# Altium project Orient.PrjPcb (part 1 of 6)
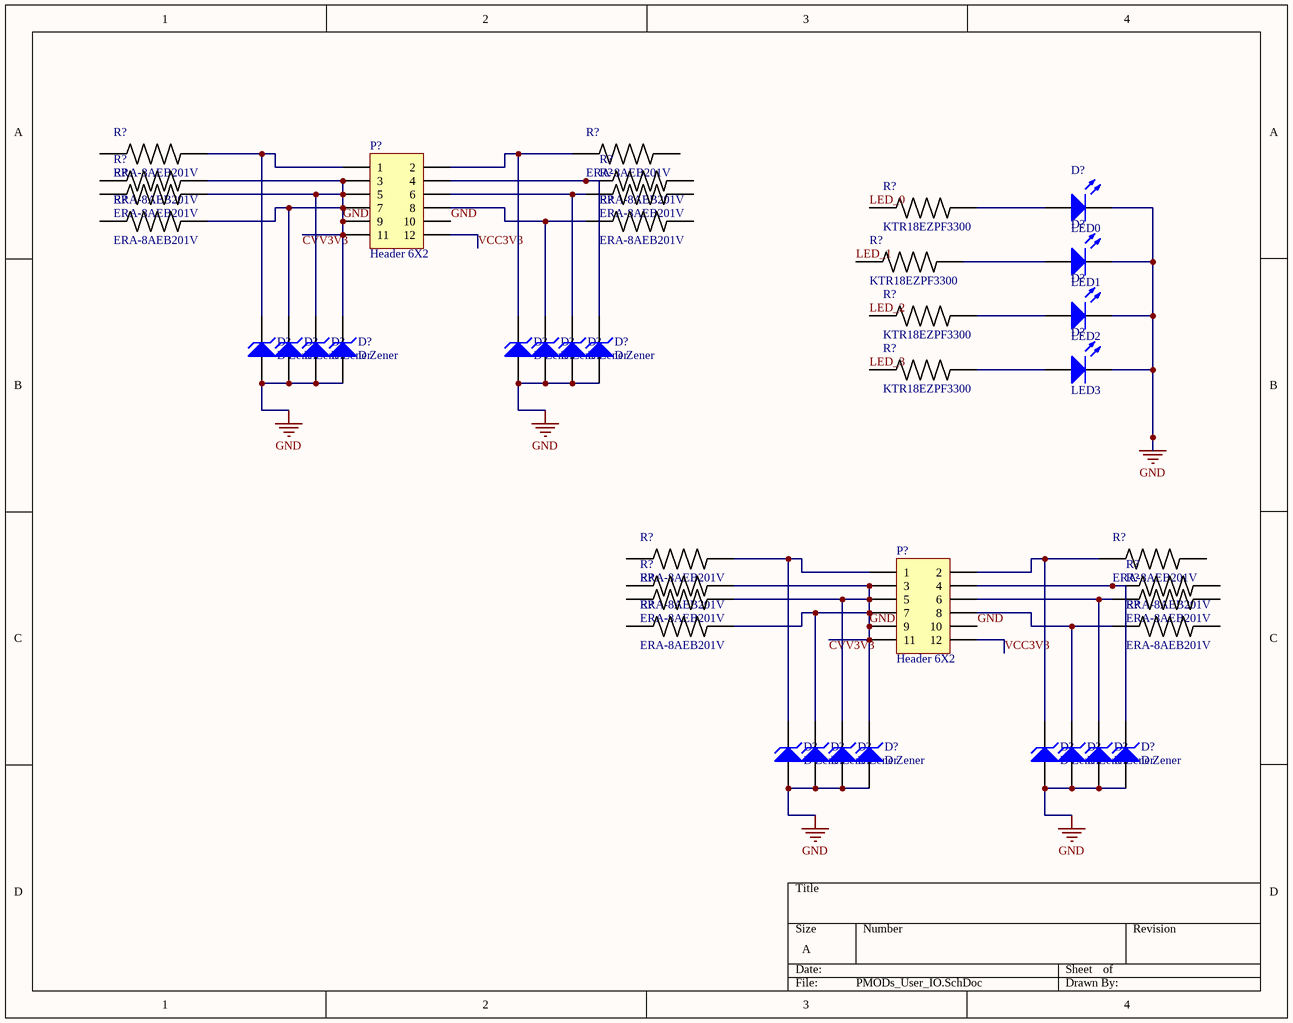
[diagram p0: PMODs_User_IO.SchDoc]
12 sheets, 302 parts. Net scope: global (net labels, ports and power ports of the same name join across sheets).
Sheets:
  PMODs_User_IO.SchDoc
  CHipKIT_IO.SchDoc
  Ethernet_SD_Card.SchDoc
  HDMI.SchDoc
  USB_Mic_Audio_Out.SchDoc
  FPGA_Config_Flash.SchDoc
  DDR_MIO_Banks.SchDoc
  FPGA_Banks_Anti_Alias.SchDoc
  FPGA_Power.SchDoc
  DDR3_Memory.SchDoc
  Power_Regulation1.SchDoc
  Power_Regulation2.SchDoc

## Sheet PMODs_User_IO.SchDoc
size A

### Parts
(Parts that share a designator on the sheet are numbered #1, #2 ... from top to bottom, then left to right.)
D?#1  LED0  [LED-0]
D?#2  LED1  [LED-1]
D?#3  LED2  [3.2X1.6X1.1]
D?#4  D Zener  [DIODE-0.7]
D?#5  D Zener  [DIODE-0.7]
D?#6  D Zener  [DIODE-0.7]
D?#7  D Zener  [DIODE-0.7]
D?#8  D Zener  [DIODE-0.7]
D?#9  D Zener  [DIODE-0.7]
D?#10  D Zener  [DIODE-0.7]
D?#11  D Zener  [DIODE-0.7]
D?#12  LED3  [3.5X2.8X1.9]
D?#13  D Zener  [DIODE-0.7]
D?#14  D Zener  [DIODE-0.7]
D?#15  D Zener  [DIODE-0.7]
D?#16  D Zener  [DIODE-0.7]
D?#17  D Zener  [DIODE-0.7]
D?#18  D Zener  [DIODE-0.7]
D?#19  D Zener  [DIODE-0.7]
D?#20  D Zener  [DIODE-0.7]
P?#1  Header 6X2  [HDR2X6]
P?#2  Header 6X2  [HDR2X6]
R?#1  ERA-8AEB201V  [*RESC3216X70N]
R?#2  ERA-8AEB201V  [*RESC3216X70N]
R?#3  ERA-8AEB201V  [*RESC3216X70N]
R?#4  ERA-8AEB201V  [*RESC3216X70N]
R?#5  ERA-8AEB201V  [*RESC3216X70N]
R?#6  ERA-8AEB201V  [*RESC3216X70N]
R?#7  KTR18EZPF3300  [*RESC3216X65N]
R?#8  ERA-8AEB201V  [*RESC3216X70N]
R?#9  ERA-8AEB201V  [*RESC3216X70N]
R?#10  KTR18EZPF3300  [*RESC3216X65N]
R?#11  KTR18EZPF3300  [*RESC3216X65N]
R?#12  KTR18EZPF3300  [*RESC3216X65N]
R?#13  ERA-8AEB201V  [*RESC3216X70N]
R?#14  ERA-8AEB201V  [*RESC3216X70N]
R?#15  ERA-8AEB201V  [*RESC3216X70N]
R?#16  ERA-8AEB201V  [*RESC3216X70N]
R?#17  ERA-8AEB201V  [*RESC3216X70N]
R?#18  ERA-8AEB201V  [*RESC3216X70N]
R?#19  ERA-8AEB201V  [*RESC3216X70N]
R?#20  ERA-8AEB201V  [*RESC3216X70N]

### Nets
GND: D?#1.2(K) D?#2.2(K) D?#3.2(K) D?#4.1(A) D?#5.1(A) D?#5.2(K) D?#6.1(A) D?#6.2(K) D?#7.1(A) D?#7.2(K) D?#8.1(A) D?#9.1(A) D?#10.1(A) D?#11.1(A) D?#12.2(K) D?#13.1(A) D?#14.1(A) D?#14.2(K) D?#15.1(A) D?#15.2(K) D?#16.1(A) D?#16.2(K) D?#17.1(A) D?#18.1(A) D?#19.1(A) D?#20.1(A) P?#1.3 P?#1.5 P?#1.7 P?#1.9 P?#1.10 P?#1.11 P?#2.3 P?#2.5 P?#2.7 P?#2.9 P?#2.10 P?#2.11 R?#3.2 R?#5.2 R?#8.2 R?#15.2 R?#17.2 R?#19.2
LED_0: R?#7.1
LED_1: R?#10.1
LED_2: R?#11.1
LED_3: R?#12.1
VCC3V3: P?#1.12 P?#2.12
NetD?#1_1: D?#1.1(A) R?#7.2
NetD?#2_1: D?#2.1(A) R?#10.2
NetD?#3_1: D?#3.1(A) R?#11.2
NetD?#4_2: D?#4.2(K) P?#1.1 R?#1.2
NetD?#8_2: D?#8.2(K) P?#1.2 R?#2.1
NetD?#9_2: D?#9.2(K) P?#1.8 R?#9.1
NetD?#10_2: D?#10.2(K) P?#1.6 R?#6.1
NetD?#11_2: D?#11.2(K) P?#1.4 R?#4.1
NetD?#12_1: D?#12.1(A) R?#12.2
NetD?#13_2: D?#13.2(K) P?#2.1 R?#13.2
NetD?#17_2: D?#17.2(K) P?#2.2 R?#14.1
NetD?#18_2: D?#18.2(K) P?#2.8 R?#20.1
NetD?#19_2: D?#19.2(K) P?#2.6 R?#18.1
NetD?#20_2: D?#20.2(K) P?#2.4 R?#16.1

Not connected (* = marked no-connect by the designer): R?#1 1; R?#2 2; R?#3 1; R?#4 2; R?#5 1; R?#6 2; R?#8 1; R?#9 2; R?#13 1; R?#14 2; R?#15 1; R?#16 2; R?#17 1; R?#18 2; R?#19 1; R?#20 2

### Notes on the sheet
- Labels drawn without touching a wire or pin: CVV3V3

### Library data of the parts
D?#1 = LED0: Typical INFRARED GaAs LED; Published: 8-Jun-2000; LatestRevisionDate: 08-Jul-2005; LatestRevisionNote: Mech Layer 1 removed.; PackageReference: LED-0; Publisher: Altium Limited; PackageDescription: LED; 2 Leads
D?#2 = LED1: Typical RED GaAs LED; Published: 8-Jun-2000; LatestRevisionDate: 08-Jul-2005; LatestRevisionNote: Mech Layer 1 removed.; PackageReference: LED-1; Publisher: Altium Limited; PackageDescription: LED; 2 Leads
D?#3 = LED2: Typical RED, GREEN, YELLOW, AMBER GaAs LED; Published: 8-Jun-2000; LatestRevisionDate: 17-Jul-2002; LatestRevisionNote: Re-released for DXP Platform.; PackageVersion: Feb-2002; PackageReference: 3.2X1.6X1.1; Publisher: Altium Limited; PackageDescription: SM LED; 2 Flat Leads
D?#4-D?#11 D?#13-D?#20 = D Zener: Zener Diode; Published: 8-Jun-2000; LatestRevisionDate: 17-Jul-2002; LatestRevisionNote: Re-released for DXP Platform.; PackageReference: DIODE-0.7; Publisher: Altium Limited; PackageDescription: Diode, Thru-Hole; 2 Leads; 0.7 in Pin Spacing
D?#12 = LED3: Typical BLUE SiC LED; Published: 8-Jun-2000; LatestRevisionDate: 17-Dec-2003; LatestRevisionNote: PCB Footprint replaced.; DatasheetVersion: 16-Apr-2002; PackageVersion: 16-Apr-2002; PackageReference: 3.5X2.8X1.9; Publisher: Altium Limited; PackageDescription: SM LED; 2 C-Bend Leads; Body 3.5 x 2.8 x 1.9 mm, inc leads (LxWxH typ)
P?#1 P?#2 = Header 6X2: Header, 6-Pin, Dual row; LatestRevisionDate: 17-Jul-2002; LatestRevisionNote: Re-released for DXP Platform.; Publisher: Altium Limited
R?#1-R?#6 R?#8 R?#9 R?#13-R?#20 = ERA-8AEB201V: / Res Thin Film 1206 200 Ohm 0.1% 0.25W_1/4W_ Â±25ppm/C Pad SMD Automotive T/R /; MF: Panasonic; SnapEDA_Link: https://www.snapeda.com/parts/ERA-8AEB201V/Panasonic%20Electronic%20Components/view-part/?ref=snap; Availability: Unavailable; Price: None; MP: ERA-8AEB201V; Package: 3216 Panasonic Electronic Components; Value: *
R?#7 R?#10-R?#12 = KTR18EZPF3300: MF: Rohm; SnapEDA_Link: https://www.snapeda.com/parts/KTR18EZPF3300/Rohm/view-part/?ref=snap; Availability: Unavailable; Price: None; MP: KTR18EZPF3300; Package: 3216 Rohm Semiconductor; Value: *

## Sheet CHipKIT_IO.SchDoc
size A
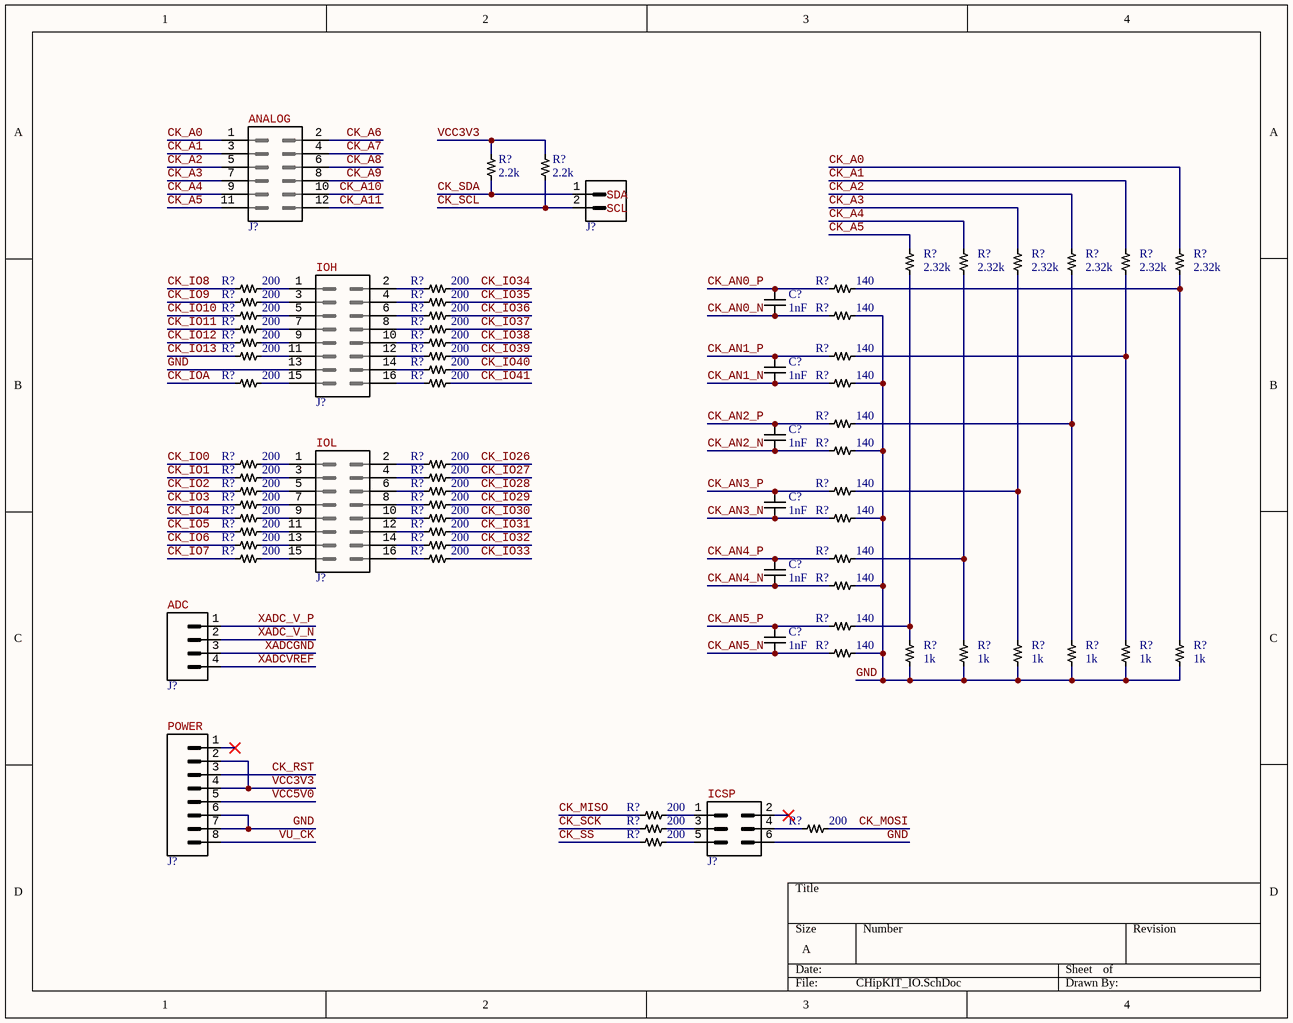
[diagram p1: CHipKIT_IO.SchDoc]

### Parts
(Parts that share a designator on the sheet are numbered #1, #2 ... from top to bottom, then left to right.)
C?#1  1nF  [CAP0402]
C?#2  1nF  [CAP0402]
C?#3  1nF  [CAP0402]
C?#4  1nF  [CAP0402]
C?#5  1nF  [CAP0402]
C?#6  1nF  [CAP0402]
J?#1  2x6 Header  [HEADER_2X6]  (value not drawn)
J?#2  1x2 Header  [HEADER_1X2]  (value not drawn)
J?#3  2x8 Header  [HEADER_2x8]  (value not drawn)
J?#4  2x8 Header  [HEADER_2x8]  (value not drawn)
J?#5  1x4 Header  [HEADER_1X4]  (value not drawn)
J?#6  1x8 Header  [HEADER_1X8]  (value not drawn)
J?#7  2x3 Header  [HEADER_2X3]  (value not drawn)
R?#21  2.2k  [RES0402]
R?#22  2.2k  [RES0402]
R?#23  2.32k  [RES0402]
R?#24  2.32k  [RES0402]
R?#25  2.32k  [RES0402]
R?#26  2.32k  [RES0402]
R?#27  2.32k  [RES0402]
R?#28  2.32k  [RES0402]
R?#29  200  [RES0402]
R?#30  200  [RES0402]
R?#31  140  [RES0402]
R?#32  200  [RES0402]
R?#33  200  [RES0402]
R?#34  200  [RES0402]
R?#35  200  [RES0402]
R?#36  140  [RES0402]
R?#37  200  [RES0402]
R?#38  200  [RES0402]
R?#39  200  [RES0402]
R?#40  200  [RES0402]
R?#41  200  [RES0402]
R?#42  200  [RES0402]
R?#43  140  [RES0402]
R?#44  200  [RES0402]
R?#45  200  [RES0402]
R?#46  200  [RES0402]
R?#47  140  [RES0402]
R?#48  140  [RES0402]
R?#49  140  [RES0402]
R?#50  200  [RES0402]
R?#51  200  [RES0402]
R?#52  200  [RES0402]
R?#53  200  [RES0402]
R?#54  200  [RES0402]
R?#55  200  [RES0402]
R?#56  140  [RES0402]
R?#57  200  [RES0402]
R?#58  200  [RES0402]
R?#59  200  [RES0402]
R?#60  200  [RES0402]
R?#61  140  [RES0402]
R?#62  200  [RES0402]
R?#63  200  [RES0402]
R?#64  200  [RES0402]
R?#65  200  [RES0402]
R?#66  200  [RES0402]
R?#67  200  [RES0402]
R?#68  140  [RES0402]
R?#69  140  [RES0402]
R?#70  140  [RES0402]
R?#71  140  [RES0402]
R?#72  1k  [RES0402]
R?#73  1k  [RES0402]
R?#74  1k  [RES0402]
R?#75  1k  [RES0402]
R?#76  1k  [RES0402]
R?#77  1k  [RES0402]
R?#78  200  [RES0402]
R?#79  200  [RES0402]
R?#80  200  [RES0402]
R?#81  200  [RES0402]

### Nets
GND: J?#3.13 J?#6.6 J?#6.7 J?#7.6 R?#36.2 R?#47.2 R?#49.2 R?#61.2 R?#69.2 R?#71.2 R?#72.1 R?#73.1 R?#74.1 R?#75.1 R?#76.1 R?#77.1
CK_A0: J?#1.1 R?#28.2
CK_A1: J?#1.3 R?#27.2
CK_A2: J?#1.5 R?#26.2
CK_A3: J?#1.7 R?#25.2
CK_A4: J?#1.9 R?#24.2
CK_A5: J?#1.11 R?#23.2
CK_A6: J?#1.2
CK_A7: J?#1.4
CK_A8: J?#1.6
CK_A9: J?#1.8
CK_A10: J?#1.10
CK_A11: J?#1.12
CK_AN0_N: C?#1.2 R?#36.1
CK_AN0_P: C?#1.1 R?#31.1
CK_AN1_N: C?#2.2 R?#47.1
CK_AN1_P: C?#2.1 R?#43.1
CK_AN2_N: C?#3.2 R?#49.1
CK_AN2_P: C?#3.1 R?#48.1
CK_AN3_N: C?#4.2 R?#61.1
CK_AN3_P: C?#4.1 R?#56.1
CK_AN4_N: C?#5.2 R?#69.1
CK_AN4_P: C?#5.1 R?#68.1
CK_AN5_N: C?#6.2 R?#71.1
CK_AN5_P: C?#6.1 R?#70.1
CK_IO0: R?#50.1
CK_IO1: R?#52.1
CK_IO2: R?#54.1
CK_IO3: R?#57.1
CK_IO4: R?#59.1
CK_IO5: R?#62.1
CK_IO6: R?#64.1
CK_IO7: R?#66.1
CK_IO8: R?#29.1
CK_IO9: R?#32.1
CK_IO10: R?#34.1
CK_IO11: R?#37.1
CK_IO12: R?#39.1
CK_IO13: R?#41.1
CK_IO26: R?#51.2
CK_IO27: R?#53.2
CK_IO28: R?#55.2
CK_IO29: R?#58.2
CK_IO30: R?#60.2
CK_IO31: R?#63.2
CK_IO32: R?#65.2
CK_IO33: R?#67.2
CK_IO34: R?#30.2
CK_IO35: R?#33.2
CK_IO36: R?#35.2
CK_IO37: R?#38.2
CK_IO38: R?#40.2
CK_IO39: R?#42.2
CK_IO40: R?#44.2
CK_IO41: R?#46.2
CK_IOA: R?#45.1
CK_MISO: R?#78.1
CK_MOSI: R?#80.2
CK_RST: J?#6.3
CK_SCK: R?#79.1
CK_SCL: J?#2.2 R?#22.1
CK_SDA: J?#2.1 R?#21.1
CK_SS: R?#81.1
VCC3V3: J?#6.2 J?#6.4 R?#21.2 R?#22.2
VCC5V0: J?#6.5
VU_CK: J?#6.8
XADC_V_N: J?#5.2
XADC_V_P: J?#5.1
XADCGND: J?#5.3
XADCVREF: J?#5.4
NetJ?#3_1: J?#3.1 R?#29.2
NetJ?#3_2: J?#3.2 R?#30.1
NetJ?#3_3: J?#3.3 R?#32.2
NetJ?#3_4: J?#3.4 R?#33.1
NetJ?#3_5: J?#3.5 R?#34.2
NetJ?#3_6: J?#3.6 R?#35.1
NetJ?#3_7: J?#3.7 R?#37.2
NetJ?#3_8: J?#3.8 R?#38.1
NetJ?#3_9: J?#3.9 R?#39.2
NetJ?#3_10: J?#3.10 R?#40.1
NetJ?#3_11: J?#3.11 R?#41.2
NetJ?#3_12: J?#3.12 R?#42.1
NetJ?#3_14: J?#3.14 R?#44.1
NetJ?#3_15: J?#3.15 R?#45.2
NetJ?#3_16: J?#3.16 R?#46.1
NetJ?#4_1: J?#4.1 R?#50.2
NetJ?#4_2: J?#4.2 R?#51.1
NetJ?#4_3: J?#4.3 R?#52.2
NetJ?#4_4: J?#4.4 R?#53.1
NetJ?#4_5: J?#4.5 R?#54.2
NetJ?#4_6: J?#4.6 R?#55.1
NetJ?#4_7: J?#4.7 R?#57.2
NetJ?#4_8: J?#4.8 R?#58.1
NetJ?#4_9: J?#4.9 R?#59.2
NetJ?#4_10: J?#4.10 R?#60.1
NetJ?#4_11: J?#4.11 R?#62.2
NetJ?#4_12: J?#4.12 R?#63.1
NetJ?#4_13: J?#4.13 R?#64.2
NetJ?#4_14: J?#4.14 R?#65.1
NetJ?#4_15: J?#4.15 R?#66.2
NetJ?#4_16: J?#4.16 R?#67.1
NetJ?#7_1: J?#7.1 R?#78.2
NetJ?#7_3: J?#7.3 R?#79.2
NetJ?#7_4: J?#7.4 R?#80.1
NetJ?#7_5: J?#7.5 R?#81.2
NetR?#23_1: R?#23.1 R?#70.2 R?#72.2
NetR?#24_1: R?#24.1 R?#68.2 R?#73.2
NetR?#25_1: R?#25.1 R?#56.2 R?#74.2
NetR?#26_1: R?#26.1 R?#48.2 R?#75.2
NetR?#27_1: R?#27.1 R?#43.2 R?#76.2
NetR?#28_1: R?#28.1 R?#31.2 R?#77.2

Not connected (* = marked no-connect by the designer): J?#6 1*; J?#7 2(4)*

### Notes on the sheet
- (near J?#1) ANALOG
- (near J?#2) SDA
- (near J?#2) SCL
- (near J?#3) IOH
- (near J?#4) IOL
- (near J?#5) ADC
- (near J?#6) POWER
- (near J?#7) ICSP

### Library data of the parts
C?#1-C?#6 = GCM155R71H102KA37D: MLCC 1nF 0402 SMD; Manufacturer: Murata; Voltage Rating: 50V; Tolerance: 10%; Dielectric: X7R; Supplier 1: Digi-Key; Manufacturer Part Number: GCM155R71H102KA37D; Stock 1: 18060146; Pricing 1: 1=0.10000, 10=0.03900, 100=0.01720, 500=0.01228, 1000=0.00965, 2500=0.00878, 5000=0.00807 (USD); RoHS: Yes; Mount: Surface Mount; Case/Package: 0402; Case Code (Metric): 1005; Case Code (Imperial): 0402; Min Operating Temperature: -55°C; Max Operating Temperature: 125°C; Package Quantity: 1; Capacitance: 1nF; Packaging: Tape and Reel; Voltage Rating (DC): 50V; Termination: SMD/SMT; Voltage: 50V; Length: 1mm; Height: 0.5mm; Width: 0.02inch; Thickness: 0.022inch; Depth: 0.5mm; Ratings: AEC-Q200; Radiation Hardening: No; REACH SVHC: No SVHC; Lead Free: Lead Free; ComponentLink1URL: https://datasheet.ciiva.com/130/product-130720.pdf?src-supplier=Digi-Key; ComponentLink1Description: https://datasheet.ciiva.com/130/product-130720.pdf?src-supplier=Digi-Key; ComponentLink2URL: https://datasheet.ciiva.com/18183/getdatasheetpartid-140970-18183520.pdf?src-supplier=Verical; ComponentLink2Description: https://datasheet.ciiva.com/18183/getdatasheetpartid-140970-18183520.pdf?src-supplier=Verical; ComponentLink3URL: https://datasheet.ciiva.com/3778/3103gcm155r71h102ka3723-3778878.pdf?src-supplier=Arrow; ComponentLink3Description: https://datasheet.ciiva.com/3778/3103gcm155r71h102ka3723-3778878.pdf?src-supplier=Arrow; ComponentLink4URL: https://datasheet.ciiva.com/11786/0900766b80ef92d0-11786143.pdf?src-supplier=RSComponents; ComponentLink4Description: https://datasheet.ciiva.com/11786/0900766b80ef92d0-11786143.pdf?src-supplier=RSComponents; ComponentLink5URL: https://datasheet.ciiva.com/16213/product-16213384.pdf?src-supplier=Future+Electronics; ComponentLink5Description: https://datasheet.ciiva.com/16213/product-16213384.pdf?src-supplier=Future+Electronics
J?#1 = PPTC062LFBN-RC: Header Female 2x6 2.54mm; Manufacturer: Sullins; Number of Positions: 12; Connector Type: Header,Socket; Pitch: 0.1inch; Supplier 1: Digi-Key; Manufacturer Part Number: PPTC062LFBN-RC; Stock 1: 4618; Pricing 1: 1=0.79000, 10=0.69100, 100=0.59600, 500=0.48762, 1000=0.43344, 5000=0.39130 (USD); RoHS: Yes; Mount: Through Hole; Color: Black; Contact Plating: Tin; Contact Material: Bronze; Housing Material: Plastic; Package Quantity: 1000; Number of Rows: 2; Packaging: Bulk; Termination: Solder; Length: 15.7mm; Height: 8.5mm; Row Spacing: 0.1inch; Width: 5mm; Lead Free: Lead Free; ComponentLink1URL: https://media.digikey.com/pdf/Data%20Sheets/Sullins%20PDFs/Female_Headers.100_DS.pdf?src-supplier=Digi-Key; ComponentLink1Description: https://media.digikey.com/pdf/Data%20Sheets/Sullins%20PDFs/Female_Headers.100_DS.pdf?src-supplier=Digi-Key; ComponentLink2URL: http://www.sullinscorp.com/catalogs/78_Page80-81_HEADER_.100_2.54mm_FEMALE.pdf?src-supplier=Future+Electronics; ComponentLink2Description: http://www.sullinscorp.com/catalogs/78_Page80-81_HEADER_.100_2.54mm_FEMALE.pdf?src-supplier=Future+Electronics
J?#2 = PPTC021LFBN-RC: Header Female 1x2 2.54mm; Manufacturer: Sullins; Number of Positions: 2; Connector Type: Header,Socket; Pitch: 0.1inch; Supplier 1: Digi-Key; Manufacturer Part Number: PPTC021LFBN-RC; Stock 1: 29257; Pricing 1: 1=0.32000, 10=0.30600, 100=0.21390, 500=0.18334, 1000=0.15278, 5000=0.13095, 10000=0.12610 (USD); RoHS: Yes; Mount: Through Hole; Color: Black; Contact Plating: Tin; Contact Material: Bronze; Housing Material: Plastic; Package Quantity: 1000; Number of Rows: 1; Packaging: Bulk; Termination: Solder; Length: 5.58mm; Height: 8.5mm; Width: 2.5mm; Lead Free: Lead Free; ComponentLink1URL: https://media.digikey.com/pdf/Data%20Sheets/Sullins%20PDFs/Female_Headers.100_DS.pdf?src-supplier=Digi-Key; ComponentLink1Description: https://media.digikey.com/pdf/Data%20Sheets/Sullins%20PDFs/Female_Headers.100_DS.pdf?src-supplier=Digi-Key; ComponentLink2URL: http://www.sullinscorp.com/catalogs/78_Page80-81_HEADER_.100_2.54mm_FEMALE.pdf?src-supplier=Future+Electronics; ComponentLink2Description: http://www.sullinscorp.com/catalogs/78_Page80-81_HEADER_.100_2.54mm_FEMALE.pdf?src-supplier=Future+Electronics
J?#3 J?#4 = PPTC082LFBN-RC: Header Female 2x8 2.54mm; Manufacturer: Sullins; Number of Positions: 16; Connector Type: Header,Socket; Pitch: 0.1inch; Supplier 1: Digi-Key; Manufacturer Part Number: PPTC082LFBN-RC; Stock 1: 5065; Pricing 1: 1=0.99000, 10=0.87000, 100=0.75040, 500=0.61398, 1000=0.54576, 5000=0.49270 (USD); RoHS: Yes; Mount: Through Hole; Color: Black; Contact Plating: Tin; Contact Material: Bronze; Housing Material: Plastic; Package Quantity: 1000; Number of Rows: 2; Packaging: Bulk; Termination: Solder; Length: 20.8mm; Height: 8.5mm; Row Spacing: 0.1inch; Width: 5mm; Lead Free: Lead Free; ComponentLink1URL: http://www.sullinscorp.com/catalogs/101_Page80-81_HEADER_.100_2.54mm_FEMALE.pdf?src-supplier=Future+Electronics; ComponentLink1Description: http://www.sullinscorp.com/catalogs/101_Page80-81_HEADER_.100_2.54mm_FEMALE.pdf?src-supplier=Future+Electronics; ComponentLink2URL: https://drawings-pdf.s3.amazonaws.com/10492.pdf?src-supplier=Digi-Key; ComponentLink2Description: https://drawings-pdf.s3.amazonaws.com/10492.pdf?src-supplier=Digi-Key
J?#5 = PPTC041LFBN-RC: Header Female 1x4 2.54mm; Manufacturer: Sullins; Number of Positions: 4; Connector Type: Header,Socket; Pitch: 0.1inch; Supplier 1: Digi-Key; Manufacturer Part Number: PPTC041LFBN-RC; Stock 1: 5302; Pricing 1: 1=0.45000, 10=0.42400, 100=0.32500, 500=0.28260, 1000=0.23315, 5000=0.20489, 10000=0.20410 (USD); RoHS: Yes; Mount: Through Hole; Color: Black; Contact Plating: Tin; Contact Material: Bronze; Housing Material: Plastic; Package Quantity: 1000; Number of Rows: 1; Packaging: Bulk; Termination: Solder; Length: 10.7mm; Height: 8.5mm; Width: 2.5mm; Lead Free: Lead Free; ComponentLink1URL: https://media.digikey.com/pdf/Data%20Sheets/Sullins%20PDFs/Female_Headers.100_DS.pdf?src-supplier=Digi-Key; ComponentLink1Description: https://media.digikey.com/pdf/Data%20Sheets/Sullins%20PDFs/Female_Headers.100_DS.pdf?src-supplier=Digi-Key; ComponentLink2URL: http://www.sullinscorp.com/catalogs/78_Page80-81_HEADER_.100_2.54mm_FEMALE.pdf?src-supplier=Future+Electronics; ComponentLink2Description: http://www.sullinscorp.com/catalogs/78_Page80-81_HEADER_.100_2.54mm_FEMALE.pdf?src-supplier=Future+Electronics
J?#6 = PPTC081LFBN-RC: Header Female 1x8 2.54mm; Manufacturer: Sullins; Number of Positions: 8; Connector Type: Header,Socket; Pitch: 0.1inch; Supplier 1: Future Electronics; Manufacturer Part Number: PPTC081LFBN-RC; Stock 1: 2015; Pricing 1: 1=0.59500, 100=0.42000, 300=0.39000, 1000=0.35500, 3000=0.32500 (USD); RoHS: Yes; Mount: Through Hole; Color: Black; Contact Plating: Tin; Contact Material: Bronze; Housing Material: Plastic; Package Quantity: 1000; Number of Rows: 1; Packaging: Bulk; Termination: Solder; Length: 20.8mm; Height: 8.5mm; Width: 2.5mm; Lead Free: Lead Free; ComponentLink1URL: https://media.digikey.com/pdf/Data%20Sheets/Sullins%20PDFs/Female_Headers.100_DS.pdf?src-supplier=Digi-Key; ComponentLink1Description: https://media.digikey.com/pdf/Data%20Sheets/Sullins%20PDFs/Female_Headers.100_DS.pdf?src-supplier=Digi-Key; ComponentLink2URL: http://www.sullinscorp.com/catalogs/78_Page80-81_HEADER_.100_2.54mm_FEMALE.pdf?src-supplier=Future+Electronics; ComponentLink2Description: http://www.sullinscorp.com/catalogs/78_Page80-81_HEADER_.100_2.54mm_FEMALE.pdf?src-supplier=Future+Electronics
J?#7 = PREC003DAAN-RC: Header Male 2x3 2.54mm
R?#21 R?#22 = RC0402FR-072K2L: Resistor 2.2kOhm 0402 SMD; Manufacturer: Yageo; Resistance: 2.2kR; Tolerance: 1%; Power Rating: 63mW; Voltage Rating: 50V; Temperature Coefficient: 100ppm/°C; Supplier 1: Digi-Key; Manufacturer Part Number: RC0402FR-072K2L; Stock 1: 12789871; Pricing 1: 1=0.10000, 10=0.01600, 100=0.00670, 1000=0.00301, 2500=0.00261, 5000=0.00215 (USD); RoHS: Yes; Case/Package: 0402; Weight: 2.3E-05oz; Case Code (Imperial): 0402; Case Code (Metric): 1005; Min Operating Temperature: -55°C; Max Operating Temperature: 155°C; Composition: Thick Film; Packaging: Tape and Reel; Termination: SMD/SMT; Military Standard: Not; Length: 1mm; Height: 0.35mm; Width: 0.5mm; Depth: 0.5mm; REACH SVHC: Unknown; Lead Free: Lead Free; ComponentLink1URL: https://datasheet.ciiva.com/11808/0900766b80c66297-11808786.pdf?src-supplier=RSComponents; ComponentLink1Description: https://datasheet.ciiva.com/11808/0900766b80c66297-11808786.pdf?src-supplier=RSComponents; ComponentLink2URL: https://datasheet.ciiva.com/12577/pyu-rc0402-51-rohs-l-6-r-12577429.pdf?src-supplier=Mouser; ComponentLink2Description: https://datasheet.ciiva.com/12577/pyu-rc0402-51-rohs-l-6-r-12577429.pdf?src-supplier=Mouser; ComponentLink3URL: https://datasheet.ciiva.com/16741/pyu-rc0402-51-rohs-l-6-r-16741015.pdf?src-supplier=Future+Electronics; ComponentLink3Description: https://datasheet.ciiva.com/16741/pyu-rc0402-51-rohs-l-6-r-16741015.pdf?src-supplier=Future+Electronics; ComponentLink4URL: https://datasheet.ciiva.com/46383/1018594-46383563.pdf?src-supplier=Element14; ComponentLink4Description: https://datasheet.ciiva.com/46383/1018594-46383563.pdf?src-supplier=Element14; ComponentLink5URL: https://datasheet.ciiva.com/7849/1018594-7849928.pdf?src-supplier=Element14; ComponentLink5Description: https://datasheet.ciiva.com/7849/1018594-7849928.pdf?src-supplier=Element14; ComponentLink6URL: https://datasheet.ciiva.com/7849/1018594-7849929.pdf?src-supplier=Element14; ComponentLink6Description: https://datasheet.ciiva.com/7849/1018594-7849929.pdf?src-supplier=Element14; ComponentLink7URL: https://datasheet.ciiva.com/7983/1018594-7983515.pdf?src-supplier=Element14; ComponentLink7Description: https://datasheet.ciiva.com/7983/1018594-7983515.pdf?src-supplier=Element14
R?#23-R?#28 = RC0402FR-072K32L: Resistor 2.32kOhm 0402 SMD; Manufacturer: Yageo; Resistance: 2.32kR; Tolerance: 1%; Temperature Coefficient: 100ppm/°C; Power Rating: 62.5mW; Voltage Rating: 50V; Max Power Dissipation: 63mW; Supplier 1: Digi-Key; Manufacturer Part Number: RC0402FR-072K32L; Stock 1: 522393; Pricing 1: 1=0.10000, 10=0.01600, 100=0.00670, 1000=0.00301, 2500=0.00261, 5000=0.00215 (USD); RoHS: Yes; Case/Package: 0402; Contact Plating: Tin,Matte; Case Code (Imperial): 0402; Case Code (Metric): 1005; Min Operating Temperature: -55°C; Max Operating Temperature: 155°C; Composition: Thick Film; Packaging: Tape and Reel; Number of Terminations: 2; Termination: SMD/SMT; Military Standard: Not; Features: Moisture Resistant; Length: 1mm; Height: 0.016inch; Width: 0.02inch; Depth: 0.5mm; ComponentLink1URL: https://datasheet.ciiva.com/8894/pyu-rc0402-51-rohs-l-6-8894485.pdf?src-supplier=Avnet; ComponentLink1Description: https://datasheet.ciiva.com/8894/pyu-rc0402-51-rohs-l-6-8894485.pdf?src-supplier=Avnet; ComponentLink2URL: https://datasheet.ciiva.com/12560/pyu-rc0402-51-rohs-l-6-r-8721-12560570.pdf?src-supplier=Mouser; ComponentLink2Description: https://datasheet.ciiva.com/12560/pyu-rc0402-51-rohs-l-6-r-8721-12560570.pdf?src-supplier=Mouser; ComponentLink3URL: https://datasheet.ciiva.com/28415/pyu-rc0402-51-rohs-l-6-28415007.pdf?src-supplier=Avnet+Europe; ComponentLink3Description: https://datasheet.ciiva.com/28415/pyu-rc0402-51-rohs-l-6-28415007.pdf?src-supplier=Avnet+Europe
R?#29 R?#30 R?#32-R?#35 R?#37-R?#42 R?#44-R?#46 R?#50-R?#55 R?#57-R?#60 R?#62-R?#67 R?#78-R?#81 = RC0402FR-07200RL: Resistor 200Ohm 0402 SMD; Manufacturer: Yageo; Tolerance: 1%; Temperature Coefficient: 100ppm/°C; Resistance: 200R; Power Rating: 63mW; Voltage Rating (DC): 50V; Supplier 1: Digi-Key; Manufacturer Part Number: RC0402FR-07200RL; Stock 1: 6380122; Pricing 1: 1=0.10000, 10=0.01600, 100=0.00670, 1000=0.00301, 2500=0.00261, 5000=0.00215 (USD); RoHS: Yes; Case/Package: 0402; Case Code (Metric): 1005; Case Code (Imperial): 0402; Min Operating Temperature: -55°C; Max Operating Temperature: 155°C; Composition: Thick Film; Packaging: Tape and Reel; Voltage Rating: 50V; Package Quantity: 1; Number of Terminations: 2; Termination: SMD/SMT; Military Standard: Not; Max Power Dissipation: 63mW; Features: Moisture Resistant; Length: 1mm; Height: 0.016inch; Depth: 0.5mm; Width: 0.02inch; REACH SVHC: No SVHC; Lead Free: Lead Free; ComponentLink1URL: https://datasheet.ciiva.com/16804/pyu-rc0402-51-rohs-l-6-r-16804406.pdf?src-supplier=Future+Electronics; ComponentLink1Description: https://datasheet.ciiva.com/16804/pyu-rc0402-51-rohs-l-6-r-16804406.pdf?src-supplier=Future+Electronics; ComponentLink2URL: https://datasheet.ciiva.com/5562/pyu-rc0402-51-rohs-l-6-r-8721-5562539.pdf?src-supplier=Mouser; ComponentLink2Description: https://datasheet.ciiva.com/5562/pyu-rc0402-51-rohs-l-6-r-8721-5562539.pdf?src-supplier=Mouser; ComponentLink3URL: https://datasheet.ciiva.com/2553/pyu-r-int-thick-7-2553232.pdf?src-supplier=Digi-Key; ComponentLink3Description: https://datasheet.ciiva.com/2553/pyu-r-int-thick-7-2553232.pdf?src-supplier=Digi-Key; ComponentLink4URL: https://datasheet.ciiva.com/7983/1018594-7983509.pdf?src-supplier=Element14; ComponentLink4Description: https://datasheet.ciiva.com/7983/1018594-7983509.pdf?src-supplier=Element14; ComponentLink5URL: https://datasheet.ciiva.com/15189/getdatasheetpartid-331152-15189383.pdf?src-supplier=Verical; ComponentLink5Description: https://datasheet.ciiva.com/15189/getdatasheetpartid-331152-15189383.pdf?src-supplier=Verical; ComponentLink6URL: https://datasheet.ciiva.com/7849/1018594-7849898.pdf?src-supplier=Element14; ComponentLink6Description: https://datasheet.ciiva.com/7849/1018594-7849898.pdf?src-supplier=Element14; ComponentLink7URL: https://datasheet.ciiva.com/7849/1018594-7849899.pdf?src-supplier=Element14; ComponentLink7Description: https://datasheet.ciiva.com/7849/1018594-7849899.pdf?src-supplier=Element14; ComponentLink8URL: https://datasheet.ciiva.com/2553/pyu-r-int-thick-7-2553230.pdf?src-supplier=Digi-Key; ComponentLink8Description: https://datasheet.ciiva.com/2553/pyu-r-int-thick-7-2553230.pdf?src-supplier=Digi-Key; ComponentLink9URL: https://datasheet.ciiva.com/2553/pyu-r-int-thick-7-2553231.pdf?src-supplier=Digi-Key; ComponentLink9Description: https://datasheet.ciiva.com/2553/pyu-r-int-thick-7-2553231.pdf?src-supplier=Digi-Key
R?#31 R?#36 R?#43 R?#47-R?#49 R?#56 R?#61 R?#68-R?#71 = RC0402FR-07140RL: Resistor 140Ohm 0420 SMD; Manufacturer: Yageo; Resistance: 140R; Tolerance: 1%; Temperature Coefficient: 100ppm/°C; Power Rating: 62.5mW; Voltage Rating: 50V; Supplier 1: Digi-Key; Manufacturer Part Number: RC0402FR-07140RL; Stock 1: 485729; Pricing 1: 1=0.10000, 10=0.01600, 100=0.00670, 1000=0.00301, 2500=0.00261, 5000=0.00215 (USD); RoHS: Yes; Case/Package: 0402; Weight: 2.3E-05oz; Contact Plating: Tin,Matte; Case Code (Imperial): 0402; Case Code (Metric): 1005; Min Operating Temperature: -55°C; Max Operating Temperature: 155°C; Composition: Thick Film; Packaging: Tape and Reel; Termination: SMD/SMT; Military Standard: Not; Voltage Rating (DC): 50V; Working Voltage: 50V; Number of Terminations: 2; Length: 1mm; Height: 0.35mm; Width: 0.5mm; Depth: 0.5mm; Lead Free: Lead Free; ComponentLink1URL: https://datasheet.ciiva.com/16744/pyu-rc0402-51-rohs-l-6-r-16744011.pdf?src-supplier=Future+Electronics; ComponentLink1Description: https://datasheet.ciiva.com/16744/pyu-rc0402-51-rohs-l-6-r-16744011.pdf?src-supplier=Future+Electronics; ComponentLink2URL: https://datasheet.ciiva.com/16869/pyu-rc0402-51-rohs-l-6-16869934.pdf?src-supplier=Avnet+Europe; ComponentLink2Description: https://datasheet.ciiva.com/16869/pyu-rc0402-51-rohs-l-6-16869934.pdf?src-supplier=Avnet+Europe; ComponentLink3URL: https://datasheet.ciiva.com/5595/pyu-rc0402-51-rohs-l-6-r-5595957.pdf?src-supplier=Mouser; ComponentLink3Description: https://datasheet.ciiva.com/5595/pyu-rc0402-51-rohs-l-6-r-5595957.pdf?src-supplier=Mouser; ComponentLink4URL: https://datasheet.ciiva.com/28394/pyu-rc0402-51-rohs-l-6-28394198.pdf?src-supplier=Avnet+Europe; ComponentLink4Description: https://datasheet.ciiva.com/28394/pyu-rc0402-51-rohs-l-6-28394198.pdf?src-supplier=Avnet+Europe; ComponentLink5URL: https://datasheet.ciiva.com/8887/pyu-rc0402-51-rohs-l-6-8887401.pdf?src-supplier=Avnet; ComponentLink5Description: https://datasheet.ciiva.com/8887/pyu-rc0402-51-rohs-l-6-8887401.pdf?src-supplier=Avnet; ComponentLink6URL: https://datasheet.ciiva.com/15189/getdatasheetpartid-323703-15189355.pdf?src-supplier=Verical; ComponentLink6Description: https://datasheet.ciiva.com/15189/getdatasheetpartid-323703-15189355.pdf?src-supplier=Verical
R?#72-R?#77 = RC0402FR-071KL: Resistor 1kOhm 0402 SMD; Manufacturer: Yageo; Tolerance: 1%; Resistance: 1kR; Temperature Coefficient: 100ppm/°C; Voltage Rating (DC): 50V; Power Rating: 62.5mW; Supplier 1: Digi-Key; Manufacturer Part Number: RC0402FR-071KL; Stock 1: 60632232; Pricing 1: 1=0.10000, 10=0.01600, 100=0.00670, 1000=0.00301, 2500=0.00261, 5000=0.00215 (USD); RoHS: Yes; Case/Package: 0402; Number of Pins: 2; Case Code (Imperial): 0402; Case Code (Metric): 1005; Min Operating Temperature: -55°C; Max Operating Temperature: 155°C; Composition: Thick Film; Packaging: Tape and Reel; Voltage Rating: 50V; Termination: SMD/SMT; Military Standard: Not; Length: 1mm; Height: 0.32mm; Width: 0.5mm; Depth: 0.5mm; REACH SVHC: Unknown; Lead Free: Lead Free; ComponentLink1URL: https://datasheet.ciiva.com/11819/0900766b80c66297-11819477.pdf?src-supplier=RSComponents; ComponentLink1Description: https://datasheet.ciiva.com/11819/0900766b80c66297-11819477.pdf?src-supplier=RSComponents; ComponentLink2URL: https://datasheet.ciiva.com/12666/pyu-rc0402-51-rohs-l-6-r-12666741.pdf?src-supplier=Mouser; ComponentLink2Description: https://datasheet.ciiva.com/12666/pyu-rc0402-51-rohs-l-6-r-12666741.pdf?src-supplier=Mouser; ComponentLink3URL: https://datasheet.ciiva.com/17063/pyu-rc0402-51-rohs-l-6-r-17063193.pdf?src-supplier=Future+Electronics; ComponentLink3Description: https://datasheet.ciiva.com/17063/pyu-rc0402-51-rohs-l-6-r-17063193.pdf?src-supplier=Future+Electronics; ComponentLink4URL: https://datasheet.ciiva.com/22747/1018594-22747513.pdf?src-supplier=Element14; ComponentLink4Description: https://datasheet.ciiva.com/22747/1018594-22747513.pdf?src-supplier=Element14; ComponentLink5URL: https://datasheet.ciiva.com/7849/1018594-7849869.pdf?src-supplier=Element14; ComponentLink5Description: https://datasheet.ciiva.com/7849/1018594-7849869.pdf?src-supplier=Element14; ComponentLink6URL: https://datasheet.ciiva.com/7983/1018594-7983502.pdf?src-supplier=Element14; ComponentLink6Description: https://datasheet.ciiva.com/7983/1018594-7983502.pdf?src-supplier=Element14; ComponentLink7URL: https://datasheet.ciiva.com/7849/1018594-7849871.pdf?src-supplier=Element14; ComponentLink7Description: https://datasheet.ciiva.com/7849/1018594-7849871.pdf?src-supplier=Element14